# EAGLE design Basisboard_REV0100 (EAGLE 9.5.1)
Selectrix Arduino
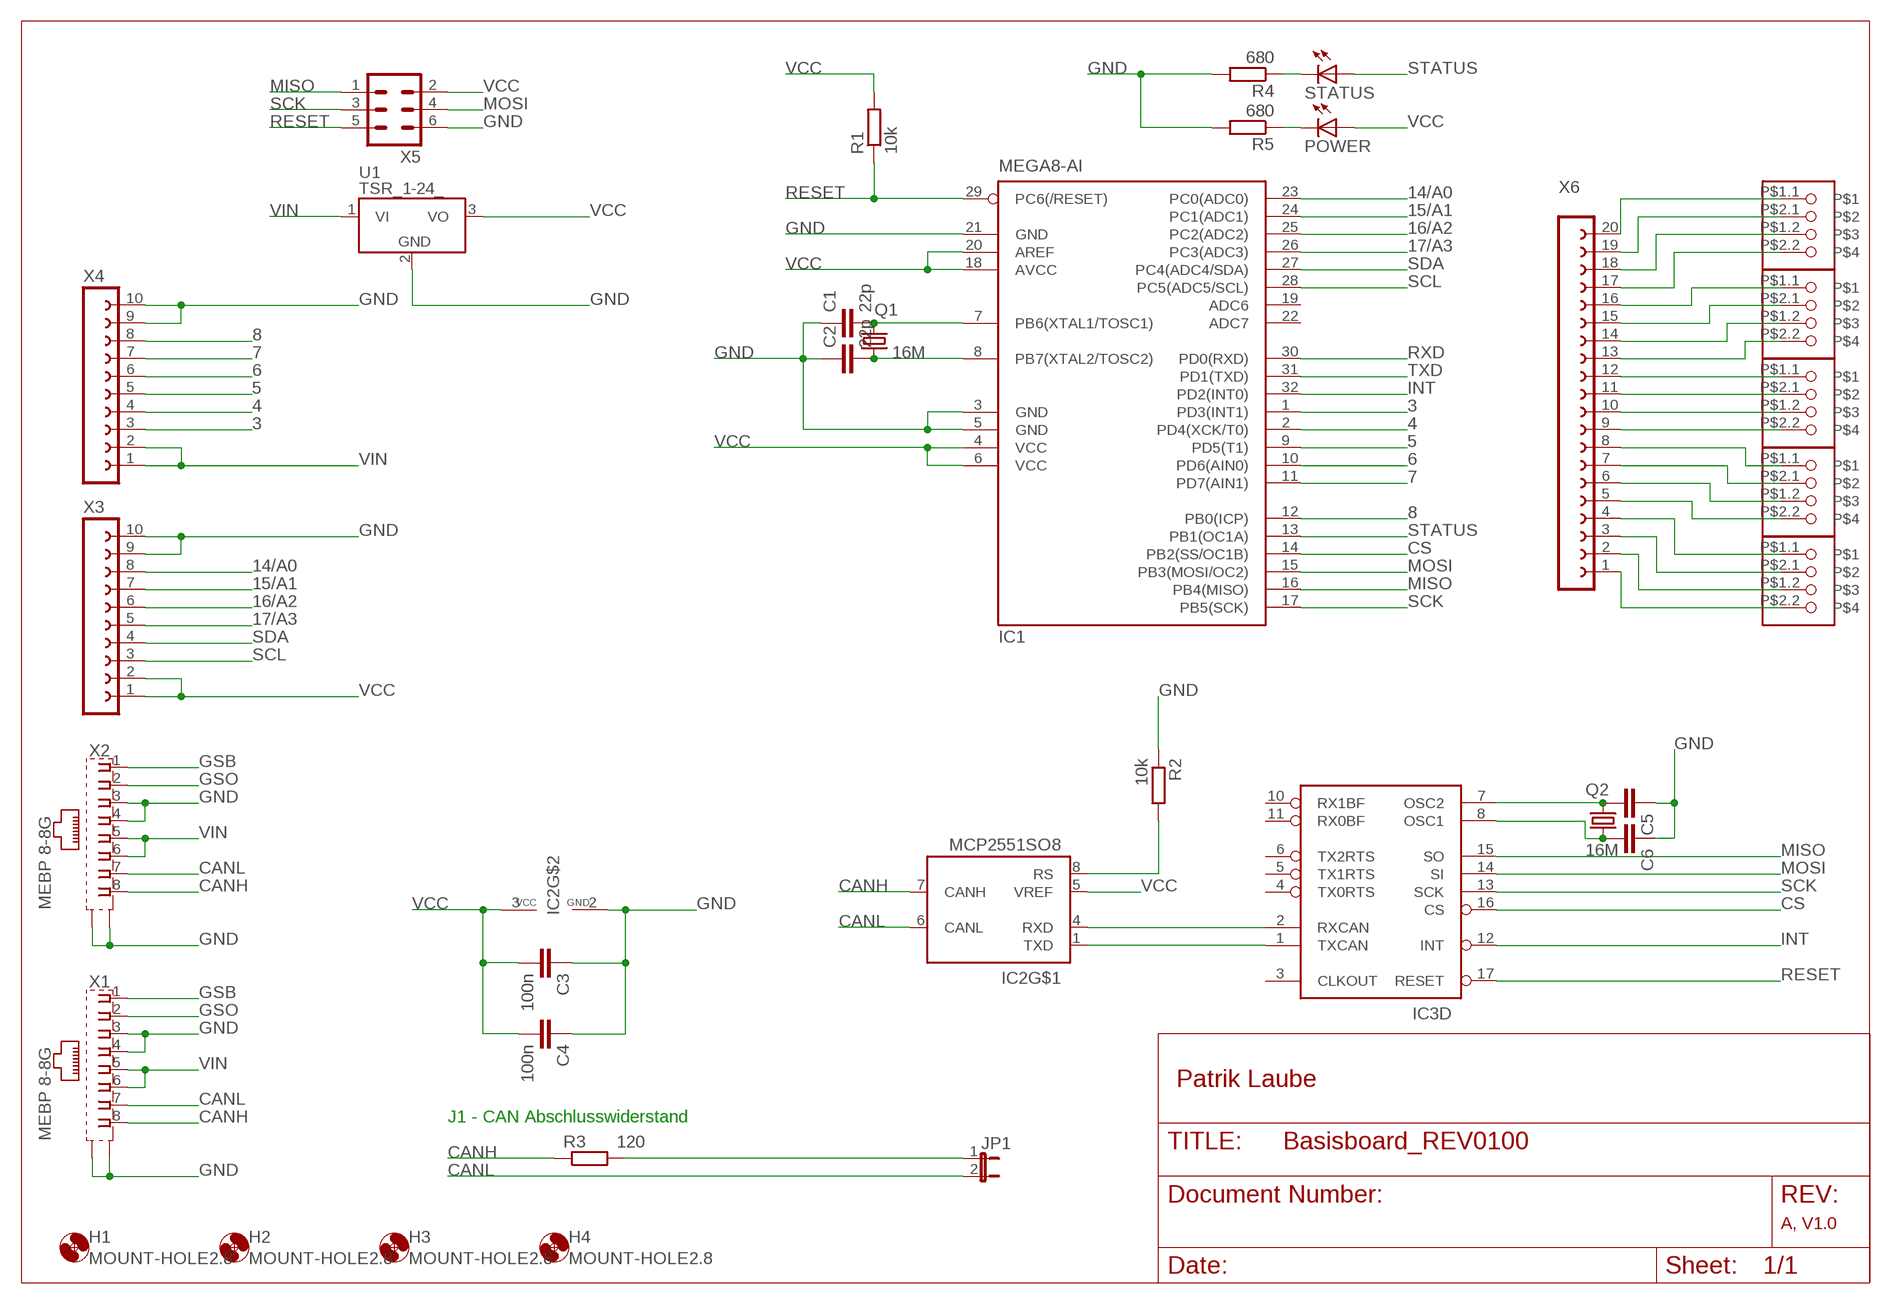
[diagram p0: schematic, sheet 1]

## Parts
C1  22p  C-EUC1206  [C1206]
C2  22p  C-EUC1206  [C1206]
C3  100n  C-EUC1206  [C1206]
C4  100n  C-EUC1206  [C1206]
C5  C-EUC1206  [C1206]
C6  C-EUC1206  [C1206]
H1  MOUNT-HOLE2.8  [2,8]
H2  MOUNT-HOLE2.8  [2,8]
H3  MOUNT-HOLE2.8  [2,8]
H4  MOUNT-HOLE2.8  [2,8]
IC1  MEGA8-AI  [TQFP32-08]
IC2  MCP2551SO8  [SO08]
IC3  MCP2515SO  [SO-18W]
JP1  JP1E  [JP1]
POWER  LEDCHIPLED_1206  [CHIPLED_1206]
Q1  16M  CRYSTALHC49S  [HC49/S]
Q2  16M  CRYSTALHC49S  [HC49/S]
R1  10k  R-EU_R1206  [R1206]
R2  10k  R-EU_R1206  [R1206]
R3  120  R-EU_R1206  [R1206]
R4  680  R-EU_R1206  [R1206]
R5  680  R-EU_R1206  [R1206]
STATUS  LEDCHIPLED_1206  [CHIPLED_1206]
U1  TSR_1-24_  [TSR-1]
U$4  AKL093-06  [AKL093-06]
U$5  AKL093-06  [AKL093-06]
U$6  AKL093-06  [AKL093-06]
U$7  AKL093-06  [AKL093-06]
U$8  AKL093-06  [AKL093-06]
X1  MEBP 8-8G  XRJF-01A-0-D22-020MEBP-8-8G  [XRJF-01A-0-D2A-010]
X2  MEBP 8-8G  XRJF-01A-0-D22-020MEBP-8-8G  [XRJF-01A-0-D2A-010]
X3  FE10-1  [FE10]
X4  FE10-1  [FE10]
X5  MA03-2  [MA03-2]
X6  FE20-1  [FE20]

## Nets
3: IC1.1(PD3(INT1)) X4.3
4: IC1.2(PD4(XCK/T0)) X4.4
5: IC1.9(PD5(T1)) X4.5
6: IC1.10(PD6(AIN0)) X4.6
7: IC1.11(PD7(AIN1)) X4.7
8: IC1.12(PB0(ICP)) X4.8
14/A0: IC1.23(PC0(ADC0)) X3.8
15/A1: IC1.24(PC1(ADC1)) X3.7
16/A2: IC1.25(PC2(ADC2)) X3.6
17/A3: IC1.26(PC3(ADC3)) X3.5
CANH: IC2.7(CANH) R3.1 X1.8 X2.8
CANL: IC2.6(CANL) JP1.2 X1.7 X2.7
CS: IC1.14(PB2(SS/OC1B)) IC3.16(D:CS)
GND: C1.1 C2.1 C3.1 C4.1 C5.1 C6.1 IC1.3(GND) IC1.5(GND) IC1.21(GND) IC2.2(GND) R2.1 R4.2 R5.2 U1.2(GND) X1.3 X1.4 X1.S1(S) X1.S2(S) X2.3 X2.4 X2.S1(S) X2.S2(S) X3.9 X3.10 X4.9 X4.10 X5.6
GSB: X1.1 X2.1
GSO: X1.2 X2.2
INT: IC1.32(PD2(INT0)) IC3.12(D:INT)
MISO: IC1.16(PB4(MISO)) IC3.15(D:SO) X5.1
MOSI: IC1.15(PB3(MOSI/OC2)) IC3.14(D:SI) X5.4
N$1: IC2.8(RS) R2.2
N$2: JP1.1 R3.2
N$3: IC2.4(RXD) IC3.2(D:RXCAN)
N$4: U$7.P$2.2 X6.1
N$7: C1.2 IC1.7(PB6(XTAL1/TOSC1)) Q1.2
N$8: C2.2 IC1.8(PB7(XTAL2/TOSC2)) Q1.1
N$9: U$7.P$1.2 X6.2
N$12: R4.1 STATUS.C
N$29: U$7.P$2.1 X6.3
N$30: IC2.1(TXD) IC3.1(D:TXCAN)
N$31: U$7.P$1.1 X6.4
N$36: U$6.P$2.2 X6.5
N$37: U$6.P$1.2 X6.6
N$38: U$6.P$2.1 X6.7
N$39: U$6.P$1.1 X6.8
N$40: U$4.P$2.2 X6.9
N$41: U$4.P$1.2 X6.10
N$42: U$4.P$2.1 X6.11
N$43: U$4.P$1.1 X6.12
N$44: U$5.P$2.2 X6.13
N$45: U$5.P$1.2 X6.14
N$46: U$5.P$2.1 X6.15
N$47: U$5.P$1.1 X6.16
N$48: U$8.P$2.2 X6.17
N$49: U$8.P$1.2 X6.18
N$50: U$8.P$2.1 X6.19
N$51: U$8.P$1.1 X6.20
N$52: POWER.C R5.1
N$54: C6.2 IC3.8(D:OSC1) Q2.2
N$55: C5.2 IC3.7(D:OSC2) Q2.1
RESET: IC1.29(PC6(/RESET)) IC3.17(D:RESET) R1.1 X5.5
RXD: IC1.30(PD0(RXD))
SCK: IC1.17(PB5(SCK)) IC3.13(D:SCK) X5.3
SCL: IC1.28(PC5(ADC5/SCL)) X3.3
SDA: IC1.27(PC4(ADC4/SDA)) X3.4
STATUS: IC1.13(PB1(OC1A)) STATUS.A
TXD: IC1.31(PD1(TXD))
VCC: C3.2 C4.2 IC1.4(VCC) IC1.6(VCC) IC1.18(AVCC) IC1.20(AREF) IC2.3(VCC) IC2.5(VREF) POWER.A R1.2 U1.3(VO) X3.1 X3.2 X5.2
VIN: U1.1(VI) X1.5 X1.6 X2.5 X2.6 X4.1 X4.2
Unconnected: IC1.19(ADC6) IC1.22(ADC7) IC3.3(D:CLKOUT) IC3.4(D:TX0RTS) IC3.5(D:TX1RTS) IC3.6(D:TX2RTS) IC3.10(D:RX1BF) IC3.11(D:RX0BF)

## Notes on the sheet
- Patrik Laube
- J1 - CAN Abschlusswiderstand
- A, V1.0

## Power pins joined to a net without a drawn wire
GND: IC3.9(P:GND)
VCC: IC3.18(P:VCC)

## Library data of the parts
C1-C6 = rcl:C-EU: CAPACITOR, European symbol
H1-H4 = holes:MOUNT-HOLE: MOUNTING HOLE with drill center marker
IC1 = atmel:MEGA8: MICROCONTROLLER 8 Kbytes FLASH, 1 kbytes SRAM, 512 bytes EEPROM, USART, 6-channel 10 bit ADC, 2-channel 8 bit ADC Pin compatible with Atmega48, ATMega88, ATMega168 Source: avr.lbr; MPN: ATMEGA8-16AU; OC_FARNELL: 9171371; OC_NEWARK: 73M8863
IC2 = can:MCP2551: CAN Tranceiver Microchip
IC3 = can:MCP2515: MC2515 Stand-Alone CAN Controller With SPI Interface, Microchip
JP1 = jumper:JP1E: JUMPER
POWER STATUS = led:LED: LED OSRAM: - CHIPLED LG R971, LG N971, LY N971, LG Q971, LY Q971, LO R971, LY R971 LH N974, LH R974 LS Q976, LO Q976, LY Q976 LO Q996 - Hyper CHIPLED LW Q18S LB Q993, LB Q99A, LB R99A - SideLED LS A670, LO A670, LY A670, LG A670, LP A670 LB A673, LV A673, LT A673, LW A673 LH A674 LY A675 LS A676, LA A676, LO A676, LY A676, LW A676 LS A679, LY A679, LG A679 - Hyper Micro SIDELED® LS Y876, LA Y876, LO Y876, LY Y876 LT Y87S - SmartLED LW L88C, LW L88S LB L89C, LB L89S, LG L890 LS L89K, LO L89K, LY L89K LS L896, LA L896, LO L896, LY L896 - TOPLED LS T670, LO T670, LY T670, LG T670, LP T670 LSG T670, LSP T670, LSY T670, LOP T670, LYG T670 LG T671, LOG T671, LSG T671 LB T673, LV T673, LT T673, LW T673 LH T674 LS T676, LA T676, LO T676, LY T676, LB T676, LH T676, LSB T676, LW T676 LB T67C, LV T67C, LT T67C, LS T67K, LO T67K, LY T67K, LW E67C LS E67B, LA E67B, LO E67B, LY E67B, LB E67C, LV E67C, LT E67C LW T67C LS T679, LY T679, LG T679 LS T770, LO T770, LY T770, LG T770, LP T770 LB T773, LV T773, LT T773, LW T773 LH T774 LS E675, LA E675, LY E675, LS T675 LS T776, LA T776, LO T776, LY T776, LB T776 LHGB T686 LT T68C, LB T68C - Hyper Mini TOPLED® LB M676 - Mini TOPLED Santana® LG M470 LS M47K, LO M47K, LY M47K Source: http://www.osram.convergy.de LUXEON: - LUMILED® LXK2-PW12-R00, LXK2-PW12-S00, LXK2-PW14-U00, LXK2-PW14-V00 LXK2-PM12-R00, LXK2-PM12-S00, LXK2-PM14-U00 LXK2-PE12-Q00, LXK2-PE12-R00, LXK2-PE12-S00, LXK2-PE14-T00, LXK2-PE14-U00 LXK2-PB12-K00, LXK2-PB12-L00, LXK2-PB12-M00, LXK2-PB14-N00, LXK2-PB14-P00, LXK2-PB14-Q00 LXK2-PR12-L00, LXK2-PR12-M00, LXK2-PR14-Q00, LXK2-PR14-R00 LXK2-PD12-Q00, LXK2-PD12-R00, LXK2-PD12-S00 LXK2-PH12-R00, LXK2-PH12-S00 LXK2-PL12-P00, LXK2-PL12-Q00, LXK2-PL12-R00 Source: www.luxeon.com KINGBRIGHT: KA-3528ASYC Source: www.kingbright.com
Q1 Q2 = crystal:CRYSTAL: CRYSTAL; OC_FARNELL: 1667008; OC_NEWARK: unknown
R1 R2 R4 R5 = rcl:R-EU_: RESISTOR, European symbol
R3 = rcl:R-EU_: RESISTOR, European symbol; SPICEPREFIX: R
U1 = Traco TSR-1:TSR_1-*: TRACO TSR-1 Series Point-of-Load DC/DC-Converters Vi max. 36 V; Vo = (1.2 .. 15)V ±2%; Io = 0 .. 1 A SIP-Package (drop-in replacement for 78xx linear voltage regulators in TO220-package, vertically assembled) Source: www.tracopower.com Technologies: TSR 1- Vi (V) Vo (V) ±2% Io = 0 .. 1 A 24_ ( generic ) 2412 4.6 .. 36 1.2 2415 4.6 .. 36 1.5 2418 4.6 .. 36 1.8 2425 4.6 .. 36 2.5 2433 4.75.. 36 3.3 2450 6.5 .. 36 5.0 2465 9.0 .. 36 6.5 2490 12 .. 36 9.0 24120 15 .. 36 12 24150 18 .. 36 15 Author: Dipl.-Ing. FH Rainer Bayer HHN Hochschule Heilbronn, rainer.bayer@hs-heilbronn.de Ingenieurbüro ing-rb, mail@ing-rb.de
U$4-U$8 = con-ria-93-04_Tha:AKL093-06
X1 X2 = con-xmultiple-MB:XRJF: RJ45 Modular Buchse, without LED, schielded Source: Reichelt MEBP 8-8G http://cdn-reichelt.de/documents/datenblatt/G100/MEBP8-8G%23IMP.pdf
X3 X4 = con-lsta:FE10-1: FEMALE HEADER; OC_FARNELL: unknown; OC_NEWARK: unknown
X5 = con-lstb:MA03-2: PIN HEADER; OC_FARNELL: unknown; OC_NEWARK: unknown
X6 = con-lsta:FE20-1: FEMALE HEADER; OC_FARNELL: unknown; OC_NEWARK: unknown

## Board
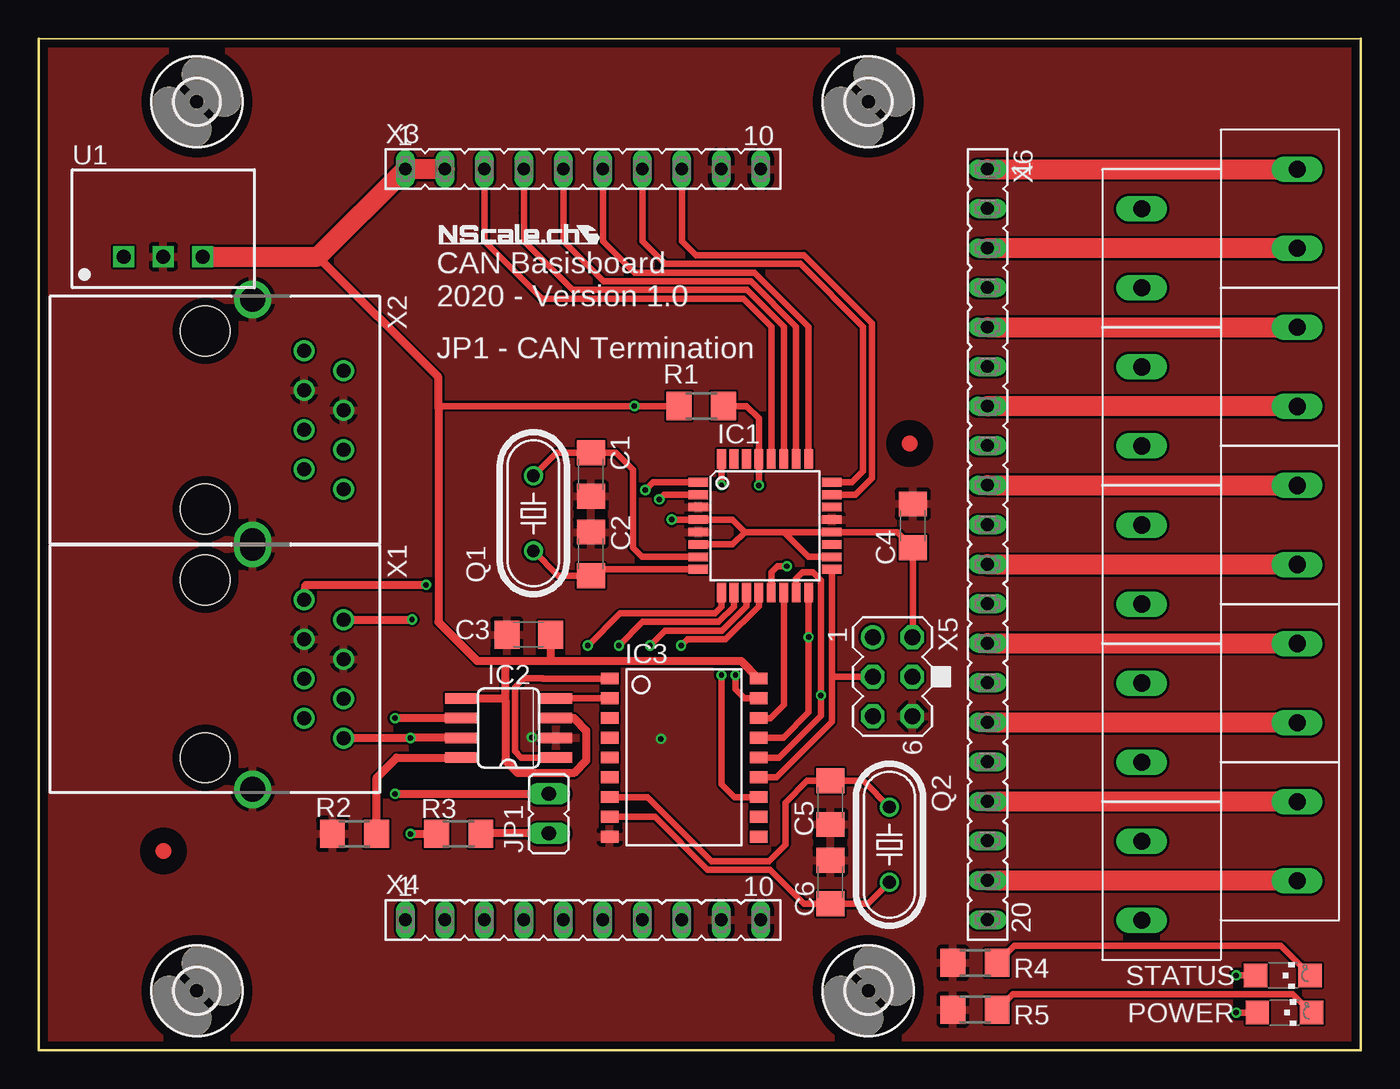
[diagram p1: board, top side]
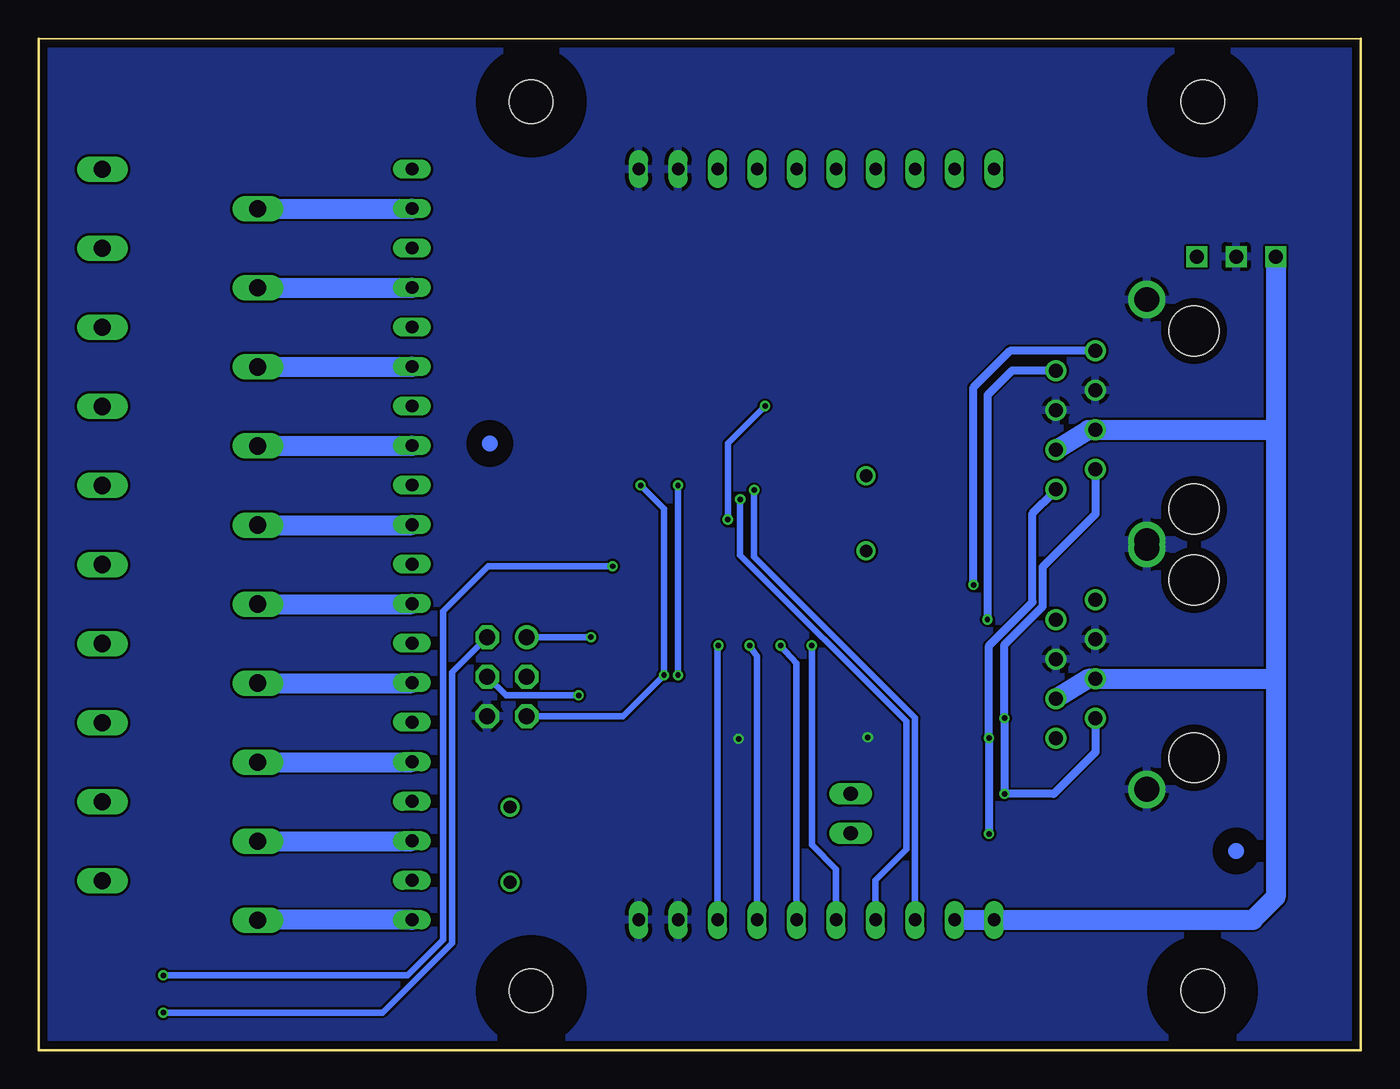
[diagram p2: board, bottom side, seen from below]

Size 85 x 65 mm. Coordinates in mm from the lower left corner, seen from the top.
Outline: 0,0 85,0 85,65 0,65 0,0
Copper layers (1*16): Top 0.035mm / dielectric 1.6mm / Bottom 0.035mm
Design rules "Elecrow_2-layer_PCB_eagle_rule": minimum track width 6mil, minimum drill 12mil, track to track 6mil, track to pad 6mil, pad to pad 6mil, via to via 8mil, smd to smd 0mil, copper to edge 20mil, drill to drill 10mil, minimum pad ring 6mil, minimum via ring 6mil, stop-mask expansion 0mil, vias tented up to drill 100mil, thermal gap 10mil

### Footprints (pad centres in the part's own frame; a part is rotated, then mirrored left to right if it is on the bottom)
C1206 = smd 1.6 x 1.8: 1 -1.4,0; 2 1.4,0
2,8 = hole 2.8: 0,0
TQFP32-08 = smd 1.27 x 0.559: 1 -4.293,2.8; 2 -4.293,2; 3 -4.293,1.2; 4 -4.293,0.4; 5 -4.293,-0.4; 6 -4.293,-1.2; 7 -4.293,-2; 8 -4.293,-2.8; 17 4.293,-2.8; 18 4.293,-2; 19 4.293,-1.2; 20 4.293,-0.4; 21 4.293,0.4; 22 4.293,1.2; 23 4.293,2; 24 4.293,2.8 | smd 0.559 x 1.27: 9 -2.8,-4.293; 10 -2,-4.293; 11 -1.2,-4.293; 12 -0.4,-4.293; 13 0.4,-4.293; 14 1.2,-4.293; 15 2,-4.293; 16 2.8,-4.293; 25 2.8,4.293; 26 2,4.293; 27 1.2,4.293; 28 0.4,4.293; 29 -0.4,4.293; 30 -1.2,4.293; 31 -2,4.293; 32 -2.8,4.293
SO08 = smd 0.66 x 2.032: 1 -1.905,-3.073; 2 -0.635,-3.073; 3 0.635,-3.073; 4 1.905,-3.073; 5 1.905,3.073; 6 0.635,3.073; 7 -0.635,3.073; 8 -1.905,3.073
SO-18W = smd 0.762 x 1.143: 1 -5.08,-4.788; 2 -3.81,-4.788; 3 -2.54,-4.788; 4 -1.27,-4.788; 5 0,-4.788; 6 1.27,-4.788; 7 2.54,-4.788; 8 3.81,-4.788; 9 5.08,-4.788; 10 5.08,4.788; 11 3.81,4.788; 12 2.54,4.788; 13 1.27,4.788; 14 0,4.788; 15 -1.27,4.788; 16 -2.54,4.788; 17 -3.81,4.788; 18 -5.08,4.788
JP1 = drill 0.914 long: 1 0,-1.27; 2 0,1.27
CHIPLED_1206 = smd 1.5 x 1.5: A 0,-1.75; C 0,1.75
HC49/S = drill 0.813: 1 -2.413,0; 2 2.413,0
R1206 = smd 1.6 x 1.803: 1 -1.422,0; 2 1.422,0
TSR-1 = drill 0.9 square: 1 -2.54,0; 2 0,0; 3 2.54,0
AKL093-06 = drill 1.1 long: P$1.1 -5.08,-6.35; P$1.2 -5.08,-1.27; P$2.1 4.92,-3.81; P$2.2 4.92,1.27
XRJF-01A-0-D2A-010 = drill 0.9 pad 1.27: 1 -4.445,6.35; 2 -3.175,8.89; 3 -1.905,6.35; 4 -0.635,8.89; 5 0.635,6.35; 6 1.905,8.89; 7 3.175,6.35; 8 4.445,8.89 | drill 1.6 pad 2.184: S1 -7.745,3.05; S2 7.745,3.05 | hole 3.2: -5.715,0; 5.715,0
FE10 = drill 0.813 long: 1 -11.43,0; 2 -8.89,0; 3 -6.35,0; 4 -3.81,0; 5 -1.27,0; 6 1.27,0; 7 3.81,0; 8 6.35,0; 9 8.89,0; 10 11.43,0
MA03-2 = drill 1.016: 1 -2.54,-1.27 | drill 1.016 octagon: 2 -2.54,1.27; 3 0,-1.27; 4 0,1.27; 5 2.54,-1.27; 6 2.54,1.27
FE20 = drill 0.813 long: 1 -24.13,0; 2 -21.59,0; 3 -19.05,0; 4 -16.51,0; 5 -13.97,0; 6 -11.43,0; 7 -8.89,0; 8 -6.35,0; 9 -3.81,0; 10 -1.27,0; 11 1.27,0; 12 3.81,0; 13 6.35,0; 14 8.89,0; 15 11.43,0; 16 13.97,0; 17 16.51,0; 18 19.05,0; 19 21.59,0; 20 24.13,0

### Placement (x,y rotation side)
C1  35.5,37 90 top
C2  35.5,31.9 270 top
C3  31.5,26.7 0 top
C4  56.2,33.7 270 top
C5  50.9,15.9 90 top
C6  50.9,10.8 270 top
H1  10.16,60.96 0 top
H2  53.34,60.96 0 top
H3  10.16,3.81 0 top
H4  53.34,3.81 0 top
IC1  46.7,33.7 0 top
IC2  30.2,20.7 90 top
IC3  41.5,18.8 270 top
JP1  32.8,15.2 0 top
POWER  80.1,2.4 270 top
Q1  31.8,34.5 90 top
Q2  54.7,13.2 270 top
R1  42.6,41.4 180 top
R2  20.3,13.9 0 top
R3  27,13.9 0 top
R4  60.2,5.6 180 top
R5  60.2,2.6 180 top
STATUS  80,4.8 270 top
U1  8,51 0 top
U$1  [CIRCLE-1MM-3R]  8,12.8 0 top
U$2  [CIRCLE-1MM-3R]  56,39 176.6 top
U$4  76,35.02 0 top
U$5  76,24.86 0 top
U$6  76,45.18 0 top
U$7  76,55.34 0 top
U$8  76,14.7 0 top
X1  10.7,24.5 270 top
X2  10.7,40.5 270 top
X3  35,56.63 0 top
X4  35,8.37 0 top
X5  54.9,24 270 top
X6  61,32.5 270 top

### Tracks (layer width: path | path; a pad name or v marks a point on that pad's centre or on a via)
3  (via drill 0.35)
  Top 0.406: v39,36 39.5,36.5 IC1.1
  Bottom 0.406: X4.3 28.65,21.35 39,31.7 v39,36
4  (via drill 0.35)
  Top 0.406: IC1.2 40.2,35.7 v39.9,35.4
  Bottom 0.406: v39.9,35.4 39.9,31.81 29.21,21.12 29.21,12.89 31.19,10.91 X4.4
5  (via drill 0.35)
  Top 0.406: IC1.9 43.9,28.5 43.48,28.08 37.38,28.08 v35.3,26
  Bottom 0.406: X4.5 33.73,11.63 35.3,13.2 v35.3,26
6  (via drill 0.35)
  Top 0.406: v37.3,26 38.82,27.52 43.71,27.52 44.7,28.51 IC1.10
  Bottom 0.406: v37.3,26 36.27,24.87 X4.6
7  (via drill 0.35)
  Top 0.406: v39.3,26 40.26,26.96 43.94,26.96 44.99,28.01 45.34,28.35 45.5,28.52 IC1.11
  Bottom 0.406: X4.7 38.81,25.31 v39.3,26
8  (via drill 0.35)
  Top 0.406: v41.3,26 41.7,26.4 44.17,26.4 46.3,28.53 IC1.12
  Bottom 0.406: X4.8 41.35,25.75 v41.3,26
14/A0
  Top 0.406: IC1.23 52.5,35.7 53.56,36.76 53.56,46.73 49.2,51.09 42.26,51.09 41.35,52 X3.8
15/A1
  Top 0.406: IC1.24 52.3,36.5 53,37.2 53,46.5 48.97,50.53 40.27,50.53 38.81,52 X3.7
16/A2
  Top 0.406: IC1.25 49.5,46.49 46.01,49.98 38.29,49.98 36.27,52 X3.6
17/A3
  Top 0.406: IC1.26 48.7,46.5 45.78,49.42 36.31,49.42 33.73,52 X3.5
CANH  (via drill 0.35)
  Top 0.508: X1.8 v23.9,20.05 23.91,20.07 IC2.7 | v23.9,13.9 R3.1
  Bottom 0.406: 19.59,35.9 X2.8
  Bottom 0.508: v23.9,13.9 v23.9,20.05 23.9,26 21.1,28.8 21.1,34.5 19.7,35.9 19.59,35.9
CANL  (via drill 0.35)
  Top 0.508: v22.9,16.47 JP1.2 | IC2.6 v22.9,21.34
  Bottom 0.508: X2.7 17.05,34.45 20.44,31.06 20.44,28.53 22.9,26.07 v22.9,21.34 v22.9,16.47 19.73,16.47 17.05,19.15 X1.7
CS
  Top 0.406: IC1.14 47.9,22.2 47.04,21.34 IC3.16
GND  (via drill 0.35)
  other vias: 31.7,20.1 40,20
  pour Top: -5,70 90,70 90,-5 -5,-5
  pour Bottom: -10,75 95,75 95,-10 -10,-10
GSB  (via drill 0.35)
  Top 0.508: X1.1 17.17,29.9 v24.9,29.9
  Bottom 0.508: v24.9,29.9 24.9,42.6 22.55,44.95 X2.1
GSO  (via drill 0.35)
  Top 0.508: X1.2 v24,27.68
  Bottom 0.508: X2.2 22.43,43.67 24,42.1 v24,27.68
INT  (via drill 0.35)
  Top 0.406: IC1.32 v43.9,36.3 | IC3.12 44.74,16.26 43.9,17.1 v43.9,24.1
  Bottom 0.406: v43.9,36.3 v43.9,24.1
MISO  (via drill 0.35)
  Top 0.406: IC1.16 v49.5,26.54 49.5,21.7 47.87,20.07 IC3.15
  Bottom 0.406: X5.1 49.66,26.54 v49.5,26.54
MOSI  (via drill 0.35)
  Top 0.406: IC1.15 48.7,30.3 49.1,30.7 49.77,30.7 50.29,30.19 v50.29,22.8 50.29,21.5 47.59,18.8 IC3.14
  Bottom 0.406: X5.4 54.97,22.8 v50.29,22.8
N$1
  Top 0.508: IC2.8 23,18.8 21.72,17.52 R2.2
N$2
  Top 0.508: JP1.1 28.57,13.93 R3.2
N$3
  Top 0.406: IC3.2 IC2.4
N$4
  Top 1.27: X6.1 80.9,56.63 U$7.P$2.2
N$7
  Top 0.406: IC1.7 38.8,31.7 38.2,32.3 38.2,37.3 37.1,38.4 C1.2 33.29,38.4 Q1.2
N$8
  Top 0.406: IC1.8 36.05,30.9 36,30.95 C2.2 33.39,30.5 Q1.1
N$9
  Bottom 1.27: U$7.P$1.2 61.02,54.07 X6.2
N$12
  Top 0.406: R4.1 62.72,6.7 79.85,6.7 STATUS.C
N$29
  Top 1.27: U$7.P$2.1 61.02,51.53 X6.3
N$30
  Top 0.406: IC3.1 32.4,23.88 32.38,23.9 31.2,23.9 30.61,23.31 30.61,19.2 31.02,18.8 IC2.1
N$31
  Bottom 1.27: U$7.P$1.1 61.02,48.99 X6.4
N$36
  Top 1.27: X6.5 80.9,46.47 U$6.P$2.2
N$37
  Bottom 1.27: U$6.P$1.2 61.02,43.91 X6.6
N$38
  Top 1.27: U$6.P$2.1 61.02,41.37 X6.7
N$39
  Bottom 1.27: U$6.P$1.1 61.02,38.83 X6.8
N$40
  Top 1.27: X6.9 80.9,36.31 U$4.P$2.2
N$41
  Bottom 1.27: U$4.P$1.2 61.02,33.75 X6.10
N$42
  Top 1.27: U$4.P$2.1 61.02,31.21 X6.11
N$43
  Bottom 1.27: U$4.P$1.1 61.02,28.67 X6.12
N$44
  Top 1.27: X6.13 80.9,26.15 U$5.P$2.2
N$45
  Bottom 1.27: U$5.P$1.2 61.02,23.59 X6.14
N$46
  Top 1.27: U$5.P$2.1 61.02,21.05 X6.15
N$47
  Bottom 1.27: U$5.P$1.1 61.02,18.51 X6.16
N$48
  Top 1.27: X6.17 80.9,15.99 U$8.P$2.2
N$49
  Bottom 1.27: X6.18 61.02,13.43 U$8.P$1.2
N$50
  Top 1.27: U$8.P$2.1 61.02,10.89 X6.19
N$51
  Bottom 1.27: X6.20 70.9,8.37 U$8.P$1.1
N$52
  Top 0.406: POWER.C 80.65,3.6 62.62,3.6 R5.1
N$54
  Top 0.406: IC3.8 39.61,14.99 43.01,11.59 47,11.59 49.19,9.4 C6.2 53.31,9.4 Q2.2
N$55
  Top 0.406: IC3.7 39.13,16.26 43.24,12.15 46.95,12.15 48,13.2 48,15.9 49.4,17.3 C5.2 53.01,17.3 Q2.1
RESET  (via drill 0.35)
  Top 0.406: IC3.17 45.39,22.61 44.8,23.2 v44.8,24.1 | v46.3,36.3 IC1.29 46.3,40.6 45.5,41.4 R1.1
  Bottom 0.406: v46.3,36.3 44.8,34.8 v44.8,24.1 47.44,21.46 X5.5
SCK
  Top 0.406: IC3.13 47.43,17.53 50.99,21.09 50.99,23.9 | 50.99,23.9 IC1.17 | X5.3 51.09,24 50.99,23.9
SCL
  Top 0.406: X3.3 28.65,52 32.35,48.3 32.55,48.3 34.3,48.3 45.3,48.3 47.1,46.5 IC1.28
SDA
  Top 0.406: IC1.27 47.9,46.5 45.54,48.86 34.33,48.86 31.19,52 31.19,53.81 X3.4
STATUS  (via drill 0.35)
  Top 0.406: STATUS.A v77,4.8 | IC1.13 47.1,30.7 47.5,31.1 v48.1,31.1
  Bottom 0.406: v48.1,31.1 56.1,31.1 59,28.2 59,7.1 61.3,4.8 v77,4.8
VCC  (via drill 0.35)
  Top 0.406: POWER.A v77,2.4 | 47.9,33.3 IC1.20 55.2,33.3 C4.2 56.2,26.57 X5.2 | 47.9,33.3 45.4,33.3 | 45.4,33.3 44.6,34.1 IC1.4 v40.7,34.1 | IC1.6 44.6,32.5 45.4,33.3 | IC1.18 49.5,31.7 47.9,33.3 | R1.2 v38.3,41.4 25.8,41.4 25.7,41.3
  Top 0.508: 17.94,51 25.7,43.24 25.7,41.3 25.7,27.5 28.2,25 30,25 | 32.9,25 45.17,25 IC3.18 | 32.9,25 30,25 | IC2.5 29.89,22.61 30,22.5 | 30,22.5 30,25 | C3.2 32.9,25 | 30,22.5 30,18.6 30.8,17.8 34.4,17.8 35.2,18.6 35.2,20.54 34.4,21.34 IC2.3
  Top 1.27: X3.2 X3.1 17.94,51 U1.3
  Bottom 0.406: X5.2 58.44,24.27 58.44,6.87 62.91,2.4 v77,2.4 | v40.7,34.1 40.7,39 v38.3,41.4
VIN
  Bottom 1.27: U1.1 5.46,40 | X1.6 17.52,23.86 X1.5 5.72,23.86 5.46,23.6 | X2.6 17.52,39.87 X2.5 5.59,39.87 5.46,40 | 5.46,40 5.46,23.6 | 5.46,23.6 5.46,9.84 6.93,8.37 X4.1 X4.2

### Text on the board
tPlace: C:/Users/Patrik Laube/Pictures/logo_sw.bmp
tNames: CAN Basisboard / 2020 - Version 1.0 | JP1 - CAN Termination